# Altium schematic sheet Esquematico_VitaLink.SchDoc
size A4; SheetNumber: 1; SheetTotal: 1
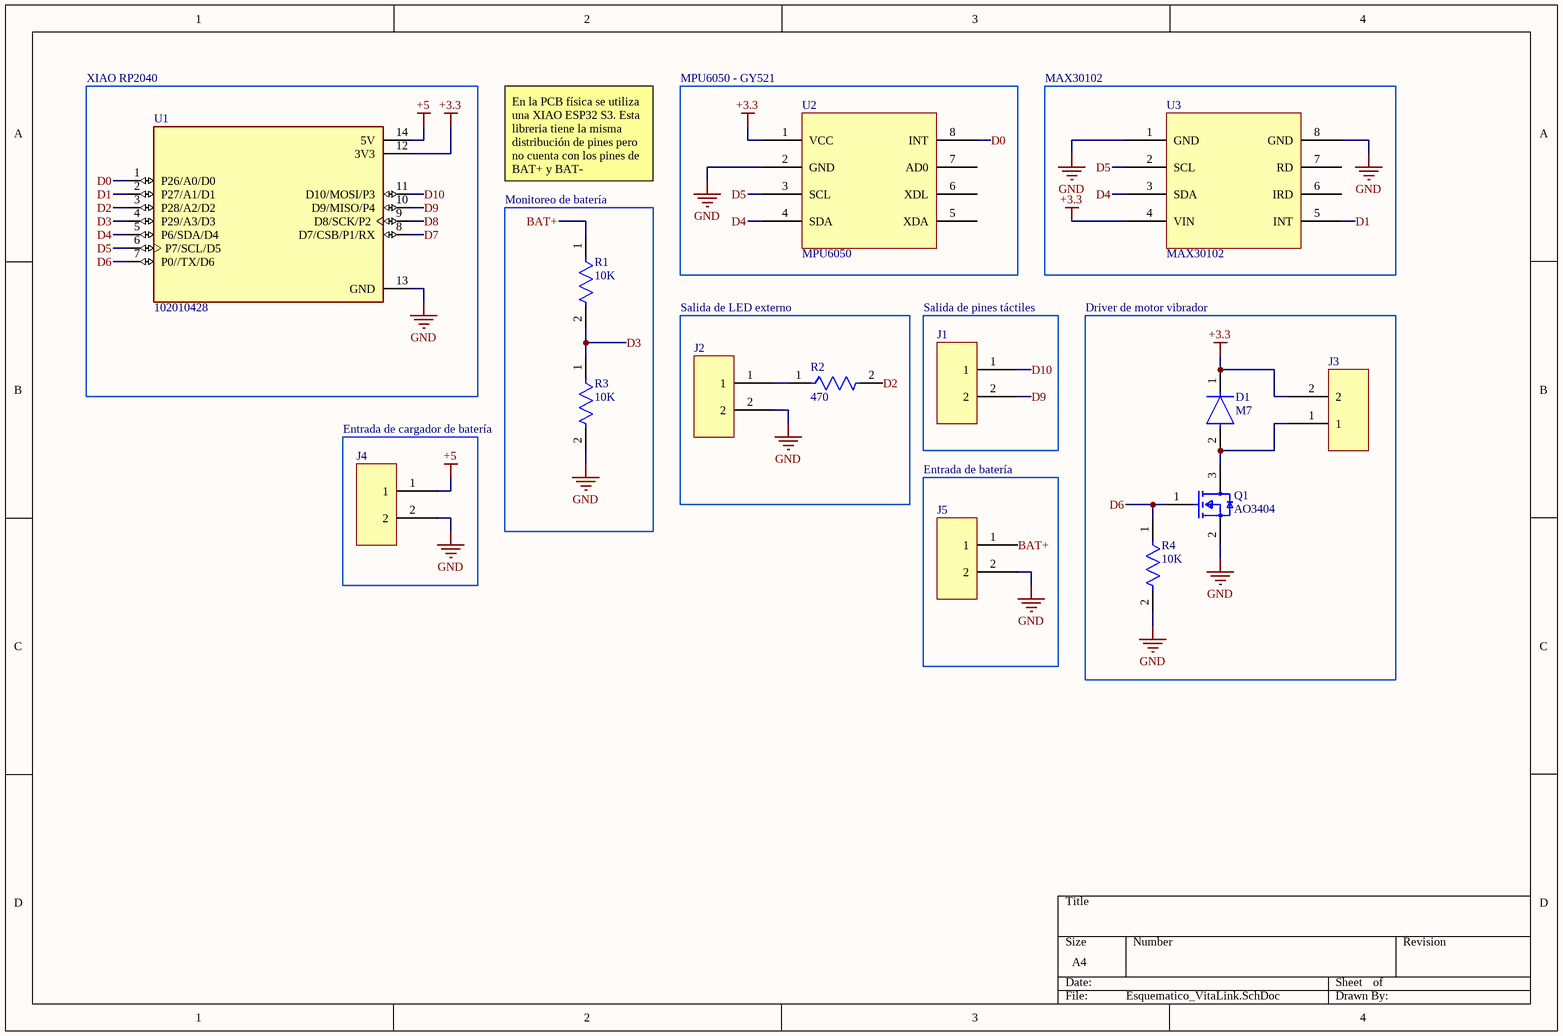
[diagram p0: Esquematico_VitaLink.SchDoc]

## Parts
D1  M7  [FP-403AE-MFG]
J1  Component_1  [PCBComponent_1]  (value not drawn)
J2  Component_1  [PCBComponent_1]  (value not drawn)
J3  Component_1  [PCBComponent_1]  (value not drawn)
J4  Component_1  [PCBComponent_1]  (value not drawn)
J5  Component_1  [PCBComponent_1]  (value not drawn)
Q1  AO3404  [FP-318-08-IPC_B]
R1  10K  [FP-RG2012-IPC_B]
R2  470  [FP-RG2012-IPC_B]
R3  10K  [FP-RG2012-IPC_B]
R4  10K  [FP-RG2012-IPC_B]
U1  102010428  [MODULE_102010428]
U2  MPU6050  [PCBComponent_1]
U3  MAX30102  [PCBComponent_1]

## Blocks framed on the sheet
XIAO RP2040: U1
MPU6050 - GY521: U2
MAX30102: U3
Monitoreo de batería: R1 R3
Salida de LED externo: J2 R2
Salida de pines táctiles: J1
Driver de motor vibrador: D1 J3 Q1 R4
Entrada de cargador de batería: J4
Entrada de batería: J5

## Nets
+3.3: D1.1(C) J3.2 U1.12(3V3) U2.1(VCC) U3.4(VIN)
+5: J4.1 U1.14(5V)
GND: J2.2 J4.2 J5.2 Q1.2(S) R3.2 R4.2 U1.13(GND) U2.2(GND) U3.1(GND) U3.8(GND)
BAT+: J5.1 R1.1
D0: U1.1(P26/A0/D0) U2.8(INT)
D1: U1.2(P27/A1/D1) U3.5(INT)
D2: R2.2 U1.3(P28/A2/D2)
D3: R1.2 R3.1 U1.4(P29/A3/D3)
D4: U1.5(P6/SDA/D4) U2.4(SDA) U3.3(SDA)
D5: U1.6(P7/SCL/D5) U2.3(SCL) U3.2(SCL)
D6: Q1.1(G) R4.1 U1.7(P0//TX/D6)
D7: U1.8(D7/CSB/P1/RX)
D8: U1.9(D8/SCK/P2)
D9: J1.2 U1.10(D9/MISO/P4)
D10: J1.1 U1.11(D10/MOSI/P3)
NetD1_2: D1.2(A) J3.1 Q1.3(D)
NetJ2_1: J2.1 R2.1

Not connected (* = marked no-connect by the designer): U2 5(XDA) 6(XDL) 7(AD0); U3 6(IRD) 7(RD)

## Notes on the sheet
- En la PCB física se utiliza una XIAO ESP32 S3. Esta libreria tiene la misma distribución de pines pero no cuenta con los pines de BAT+ y BAT-

## Library data of the parts
D1 = CMP-00278-84324859-1: ES1H Rectifier Diode, 1 Phase, 1 Element, 1A, 500V V(RRM), Silicon, DO-214AC; Manufacturer Lifecycle Status: ACTIVE, NOT REC; Recovery Time: 35ns; Forward Voltage: 1.7V; Peak Non-Repetitive Surge Current: 30A; Element Configuration: Single; Capacitance: 8pF; Max Junction Temperature (Tj): 150°C; Peak Reverse Current: 5µA; Forward Current: 1A; Reverse Recovery Time: 35ns; Weight: 106mg; REACH SVHC: No SVHC; Case/Package: SMA; RoHS: Compliant; Mount: Surface Mount; Max Forward Surge Current (Ifsm): 30A; NexarPartId: 84324859; Reverse Voltage: 500V; Radiation Hardening: No; Max Reverse Voltage (DC): 500V; Max Repetitive Reverse Voltage (Vrrm): 500V; Termination: SMD/SMT; Packaging: Cut Tape; Width: 2.896mm; Min Operating Temperature: -55°C; Schedule B: 8541100080, 8541100080; Number of Pins: 2; Height: 2.235mm; Contact Plating: Tin; Max Surge Current: 30A; Lifecycle Status: NRND; Max Operating Temperature: 150°C; Lead Free: Lead Free; Length: 4.6mm; Average Rectified Current: 1A
Q1 = CMP-07173-000101-1: MOSFET N-CH 50V 220MA SOT-23; Turn-Off Delay Time: 20ns; Element Configuration: Single; Rds On Max: 3.5R; Gate to Source Voltage (Vgs): 20V; Threshold Voltage: 1.3V; Number of Elements: 1; Power Dissipation: 360mW; Rise Time: 9ns; Turn-On Delay Time: 2.5ns; Input Capacitance: 27pF; On-State Resistance: 6R; Lead Free: Lead Free; Length: 2.92mm; Width: 1.3mm; Drain to Source Breakdown Voltage: 50V; Min Operating Temperature: -55°C; REACH SVHC: No SVHC; Packaging: Tape and Reel; Radiation Hardening: No; Height: 0.93mm; Drain to Source Voltage (Vdss): 50V; Current Rating: 220mA; Voltage Rating (DC): 50V; Weight: 0.03g; Continuous Drain Current (ID): 220mA; Number of Pins: 3; Nominal Vgs: 1.3V; Max Power Dissipation: 360mW; Fall Time: 9ns; Drain to Source Resistance: 3.5R; Contact Plating: Tin; Case/Package: SOT-23; Package Quantity: 1; Dual Supply Voltage: 50V; Mount: Surface Mount; Termination: SMD/SMT; Max Operating Temperature: 150°C
R1-R4 = CMP-28537-010674-1: Automotive Metal Thin Film Chip Resistor, 0805, 470Ω, 0.1%, 25ppm/°C, 0.125W, 150V; Power Rating: 125mW; Resistance: 470R; Min Operating Temperature: -55°C; Voltage Rating: 150V; Length: 2mm; Features: Automotive AEC-Q200; Max Operating Temperature: 155°C; Weight: 0.000194oz; Series: RG; Case Code (Metric): 2012; Max Power Dissipation: 125mW; Height: 0.4mm; Case Code (Imperial): 0805; Tolerance: 0.1%; Lead Free: Lead Free; Voltage Rating (DC): 150V; Temperature Coefficient: 25ppm/°C; Packaging: Tape and Reel; Termination: SMD/SMT; Number of Terminations: 2; Case/Package: 0805; Resistor Type: Thin Film; RoHS Compliant: Yes; Width: 1.2mm
U1 = 102010428: RP2040 XIAO RP2040 series ARMÂ® CortexÂ®-M0+ MCU 32-Bit Embedded Evaluation Board; MF: Seeed Technology Co., Ltd; SnapEDA_Link: https://www.snapeda.com/parts/102010428/Seeed+Technology+Co.%252C+Ltd/view-part/?ref=snap; Package: None; Value: *; MP: 102010428; Check_prices: https://www.snapeda.com/parts/102010428/Seeed+Technology+Co.%252C+Ltd/view-part/?ref=eda
U2 = Component_1
U3 = Component_1: pin to pad: 5>8 6>7 7>6 8>5